# EAGLE design BB-OR-NAND.v1.1 (EAGLE 7.1.0)

## Sheet 1 of 2: NAND
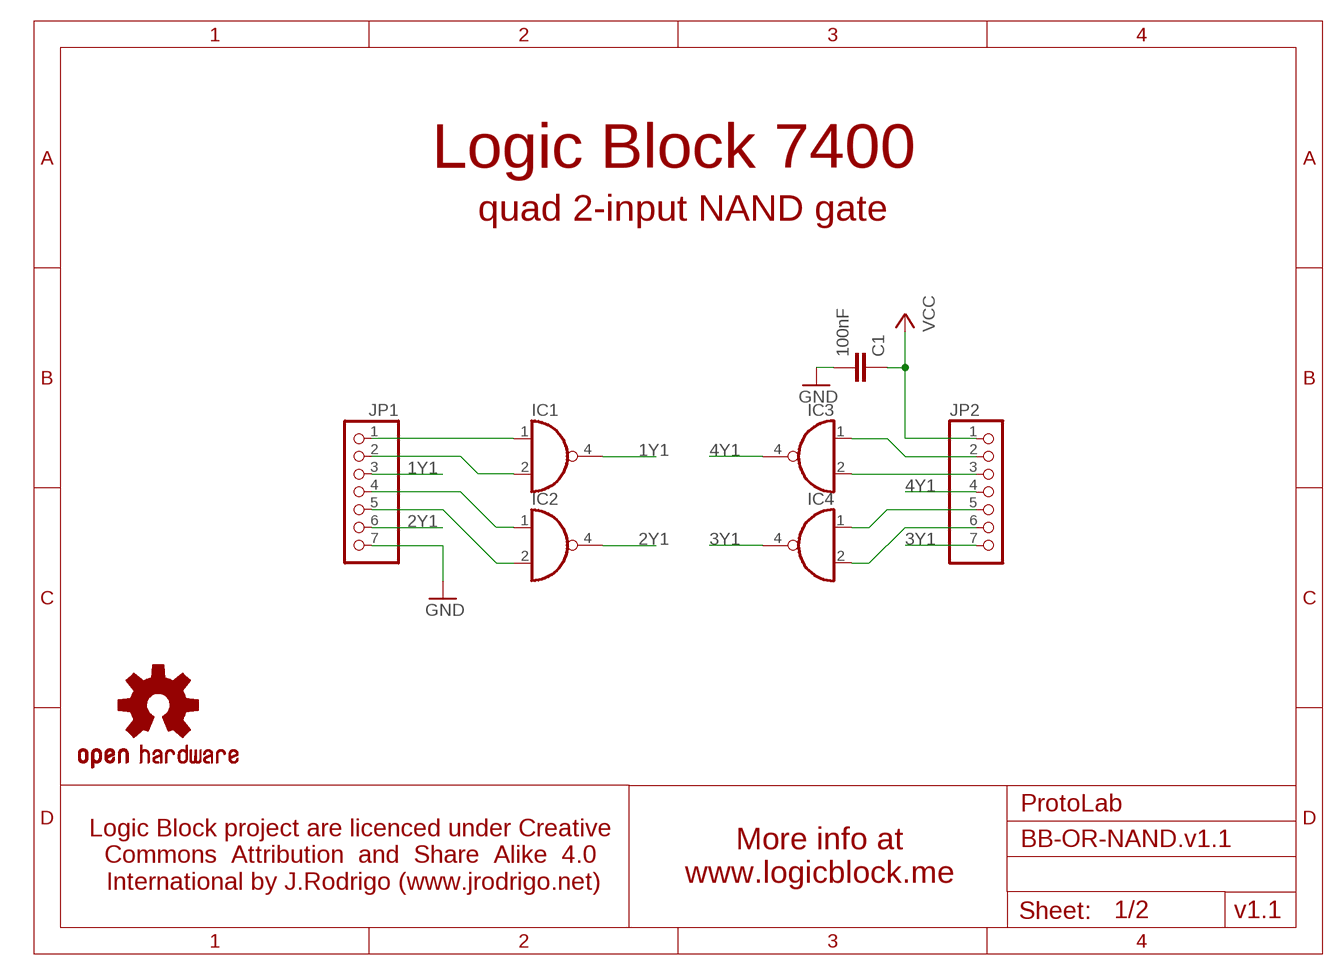
[diagram p0: schematic, sheet 1]

### Parts
C1  100nF  C-EUC0603K  [C0603K]
IC1  74AHC1G00DCK  [SC70-5]
IC2  74AHC1G00DCK  [SC70-5]
IC3  74AHC1G00DCK  [SC70-5]
IC4  74AHC1G00DCK  [SC70-5]
JP1  CON_1X7CLEANBIG  [CON_1X07-CLEANBIG]
JP2  CON_1X7CLEANBIG  [CON_1X07-CLEANBIG]
U$1  OSHW-LOGOS-LAYER230  [OSHW-LOGO-S_LAYER230]

### Nets
1Y1: IC1.4(O) JP1.3
2Y1: IC2.4(O) JP1.6
3Y1: IC4.4(O) JP2.7
4Y1: IC3.4(O) JP2.4
GND: C1.2 JP1.7 ; also sheet 2
N$1: IC1.1(I0) JP1.1
N$2: IC1.2(I1) JP1.2
N$4: IC4.2(I1) JP2.6
N$5: IC2.1(I0) JP1.4
N$6: IC2.2(I1) JP1.5
N$7: IC4.1(I0) JP2.5
N$9: IC3.2(I1) JP2.3
N$10: IC3.1(I0) JP2.2
VCC: C1.1 JP2.1 ; also sheet 2

### Notes on the sheet
- Logic Block 7400
- quad 2-input NAND gate
- ProtoLab
- More info at
  www.logicblock.me
- Logic Block project are licenced under Creative 
  Commons  Attribution  and  Share  Alike  4.0 
  International by J.Rodrigo (www.jrodrigo.net)
- v1.1

## Sheet 2 of 2: OR
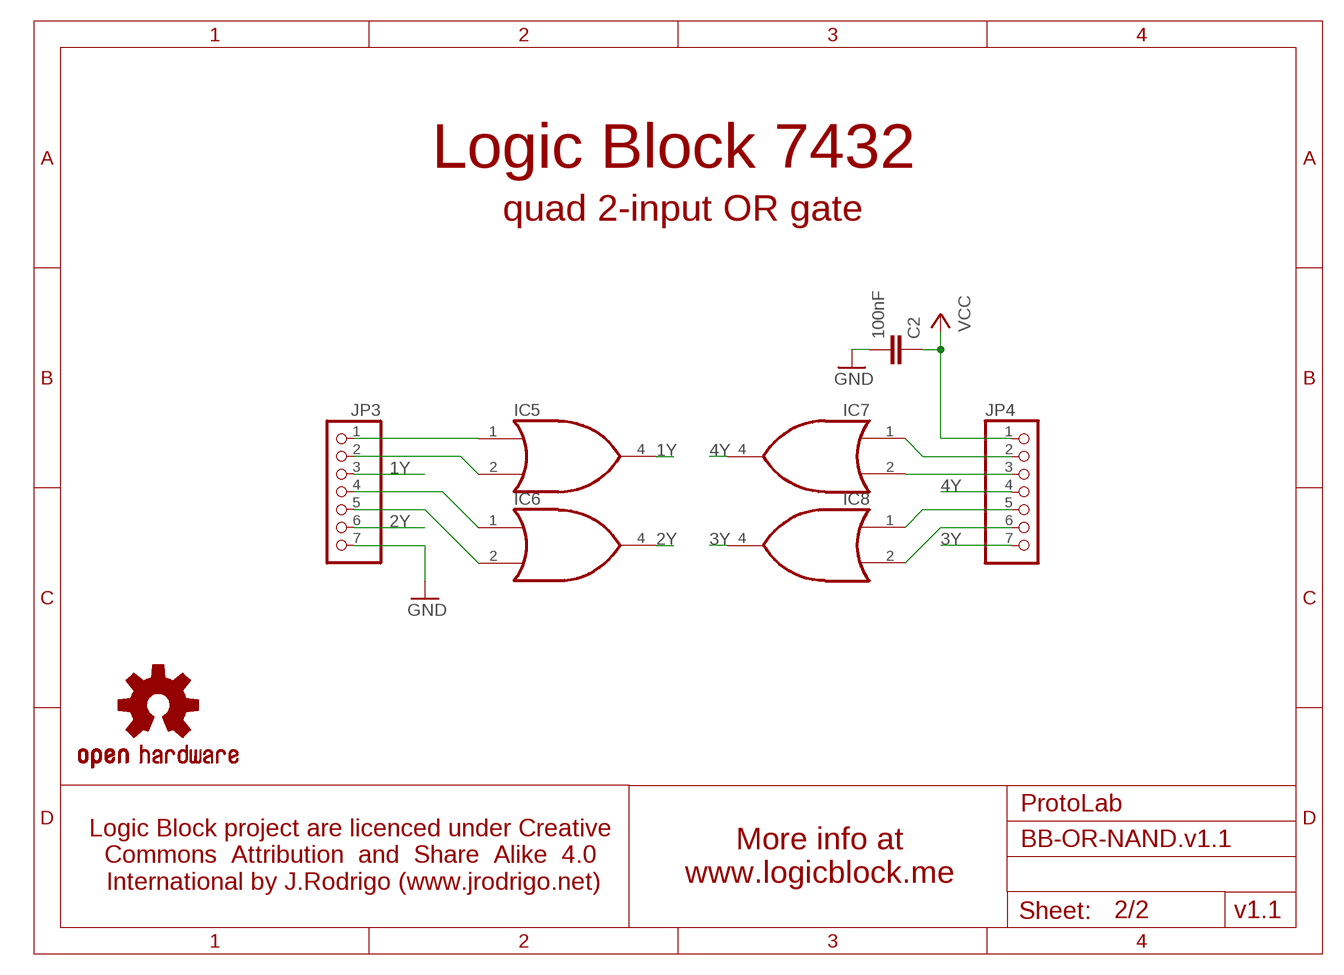
[diagram p1: schematic, sheet 2]

### Parts
C2  100nF  C-EUC0603K  [C0603K]
IC5  74AHC1G32DCK  [SC70-5]
IC6  74AHC1G32DCK  [SC70-5]
IC7  74AHC1G32DCK  [SC70-5]
IC8  74AHC1G32DCK  [SC70-5]
JP3  CON_1X7CLEANBIG  [CON_1X07-CLEANBIG]
JP4  CON_1X7CLEANBIG  [CON_1X07-CLEANBIG]
U$2  OSHW-LOGOS-LAYER230  [OSHW-LOGO-S_LAYER230]

### Nets
1Y: IC5.4(O) JP3.3
2Y: IC6.4(O) JP3.6
3Y: IC8.4(O) JP4.7
4Y: IC7.4(O) JP4.4
GND: C2.2 JP3.7 ; also sheet 1
N$13: IC5.1(I0) JP3.1
N$14: IC5.2(I1) JP3.2
N$16: IC6.1(I0) JP3.4
N$17: IC6.2(I1) JP3.5
N$20: IC8.2(I1) JP4.6
N$21: IC8.1(I0) JP4.5
N$22: IC7.2(I1) JP4.3
N$23: IC7.1(I0) JP4.2
VCC: C2.1 JP4.1 ; also sheet 1

### Notes on the sheet
- Logic Block 7432
- quad 2-input OR gate
- ProtoLab
- More info at
  www.logicblock.me
- Logic Block project are licenced under Creative 
  Commons  Attribution  and  Share  Alike  4.0 
  International by J.Rodrigo (www.jrodrigo.net)
- v1.1

## Power pins joined to a net without a drawn wire
GND: IC1.3(GND) IC2.3(GND) IC3.3(GND) IC4.3(GND) IC5.3(GND) IC6.3(GND) IC7.3(GND) IC8.3(GND)
VCC: IC1.5(VCC) IC2.5(VCC) IC3.5(VCC) IC4.5(VCC) IC5.5(VCC) IC6.5(VCC) IC7.5(VCC) IC8.5(VCC)

## Library data of the parts
C1 C2 = rcl:C-EU: CAPACITOR, European symbol
IC1-IC4 = 74xx-little-de:74*1G00: 2-input NAND gate
IC5-IC8 = 74xx-little-us:74*1G32: 2-input OR gate
JP1-JP4 = Ardublog:CON_1X7: PIN HEADER
U$1 U$2 = logicblock:OSHW-LOGO: Open Source Hardware Logo This logo indicates the piece of hardware it is found on incorporates a OSHW license and/or adheres to the definition of open source hardware found here: http://freedomdefined.org/OSHW

## Board
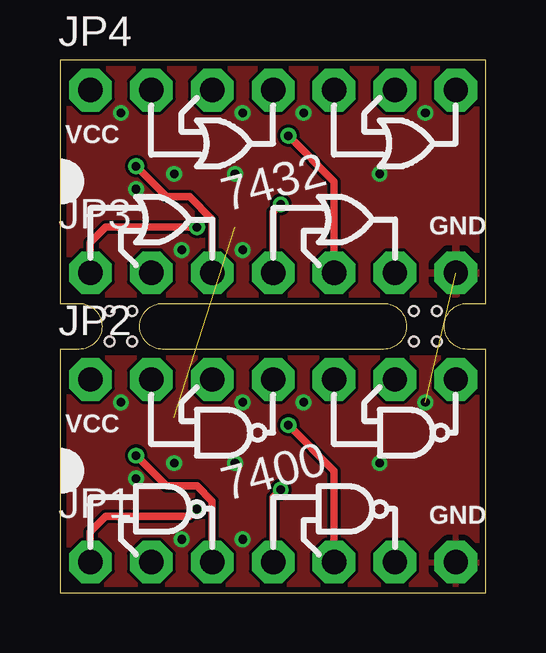
[diagram p2: board, top side]
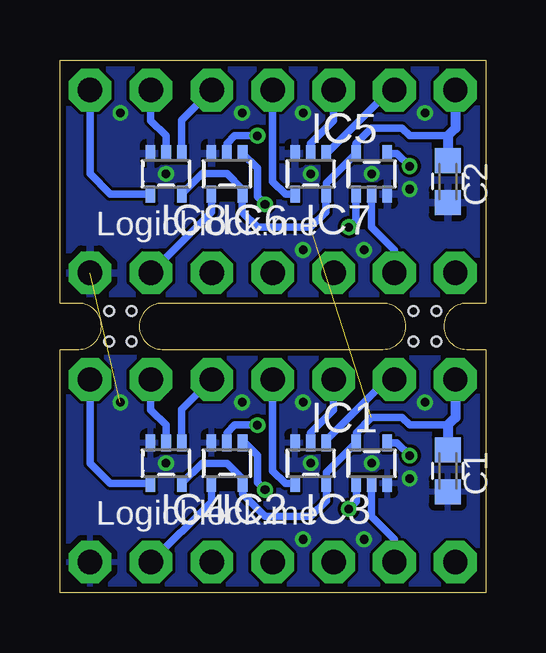
[diagram p3: board, bottom side, seen from below]

Size 17.76 x 22.21 mm. Coordinates in mm from the lower left corner, seen from the top.
Outline: 0,0 17.76,0 17.76,10.15 16.99,10.15 arc-180 16.99,12.06 17.76,12.06 17.76,22.21 0,22.21 0,12.06 0.79,12.06 arc-180 0.79,10.15 0,10.15 0,0
Outline: 13.49,10.15 4.29,10.15 arc-180 4.29,12.06 13.49,12.06 arc-180 13.49,10.15
Copper layers (1*16): Top 0.035mm / dielectric 1.5mm / Bottom 0.035mm
Design rules "dirt_cheap_dirty_boards.v1": minimum track width 5mil, minimum drill 12mil, track to track 5mil, track to pad 5mil, pad to pad 5mil, via to via 5mil, smd to smd 0mil, copper to edge 10mil, drill to drill 10mil, minimum pad ring 10mil, minimum via ring 6mil, stop-mask expansion 2mil, vias tented up to drill 25mil, thermal gap 10mil
Holes 0.4 mm at 2.06,11.75 3.02,11.75 2.06,10.48 3.02,10.48 14.76,11.75 15.72,11.75 15.72,10.48 14.76,10.48
tRestrict: 4 lines
bRestrict: 8 lines

### Footprints (pad centres in the part's own frame; a part is rotated, then mirrored left to right if it is on the bottom)
C0603K = smd 1.05 x 1.08: 1 -0.875,0; 2 0.875,0
SC70-5 = smd 0.4 x 0.7: 1 -0.65,-0.85; 2 0,-0.85; 3 0.65,-0.85; 4 0.65,0.85; 5 -0.65,0.85
CON_1X07-CLEANBIG = drill 1.016 pad 1.778 octagon: 1 -8.89,0; 2 -6.35,0; 3 -3.81,0; 4 -1.27,0; 5 1.27,0; 6 3.81,0; 7 6.35,0

### Placement (x,y rotation side)
C1  1.59,5.08 270 bottom
C2  1.59,17.14 270 bottom
IC1  4.76,5.4 0 bottom
IC2  10.79,5.4 180 bottom
IC3  7.3,5.4 180 bottom
IC4  13.34,5.4 180 bottom
IC5  4.76,17.46 0 bottom
IC6  10.79,17.46 180 bottom
IC7  7.3,17.46 180 bottom
IC8  13.34,17.46 180 bottom
JP1  10.16,1.27 0 top
JP2  10.16,8.89 0 top
JP3  10.16,13.34 0 top
JP4  10.16,20.95 0 top
U$1  16,5.4 0 top
U$2  16,17.46 0 top

### Tracks (layer width: path | path; a pad name or v marks a point on that pad's centre or on a via)
1Y  (via drill 0.36)
  Top 0.305: v3.17,17.78 4.45,16.51 5.4,16.51 6.35,15.56 JP3.3
  Bottom 0.305: IC5.4 3.71,18.31 v3.17,17.78
1Y1  (via drill 0.36)
  Top 0.305: v3.17,5.71 4.45,4.45 5.71,4.45 6.35,3.81 JP1.3
  Bottom 0.305: IC1.4 3.71,6.25 v3.17,5.71
2Y
  Bottom 0.305: IC6.4 11.45,15.86 JP3.6
2Y1
  Bottom 0.305: IC2.4 11.45,3.79 JP1.6
3Y
  Bottom 0.305: IC8.4 15.66,16.61 16.51,17.46 JP4.7
3Y1
  Bottom 0.305: IC4.4 15.66,4.55 16.51,5.4 JP2.7
4Y
  Bottom 0.305: IC7.4 8.36,16.61 8.89,17.14 JP4.4
4Y1
  Bottom 0.305: IC3.4 8.36,4.55 8.89,5.08 JP2.4
GND  (via drill 0.36)  (1 unrouted)
  other vias: 5.08,2.22 2.54,7.94 7.62,7.94 15.24,7.94 7.62,2.22 10.16,7.94 3.17,4.76 4.76,5.4 7.3,5.4 13.34,5.4 2.54,20 7.62,20 10.16,20 15.24,20 13.34,17.46 7.3,17.46 5.08,14.29 7.62,14.29 3.17,16.83 4.76,17.46
  pour Bottom: 0,0 0,10.16 17.78,10.16 17.78,0
  pour Top: 0,0 0,10.16 17.78,10.16 17.78,0
  pour Bottom: 0,12.06 17.78,12.06 17.78,22.23 0,22.23
  pour Top: 0,12.06 17.78,12.06 17.78,22.23 0,22.23
N$1  (via drill 0.36)
  Top 0.305: v5.71,3.49 5.4,3.17 1.91,3.17 1.27,2.54 JP1.1
  Bottom 0.305: IC1.1 5.41,4.43 5.4,4.43 5.4,3.81 v5.71,3.49
N$2
  Bottom 0.305: IC1.2 4.76,3.17 3.81,2.22 JP1.2
N$4
  Bottom 0.305: JP2.6 13.97,7.62 13.34,6.99 IC4.2
N$5  (via drill 0.36)
  Top 0.305: v9.21,4.29 8.89,3.97 JP1.4
  Bottom 0.305: IC2.1 10.14,6.37 10.18,6.37 9.53,5.71 9.53,4.6 v9.21,4.29
N$6  (via drill 0.36)
  Top 0.305: v9.53,6.99 11.43,5.08 JP1.5
  Bottom 0.305: IC2.2 10.79,6.67 10.48,6.99 v9.53,6.99
N$7
  Bottom 0.305: IC4.1 12.69,7.63 JP2.5
N$9
  Bottom 0.305: IC3.2 7.3,6.67 6.35,7.62 JP2.3
N$10
  Bottom 0.305: IC3.1 6.65,6.37 4.13,8.89 JP2.2
N$13  (via drill 0.36)
  Top 0.305: v5.71,15.24 1.91,15.24 1.27,14.61 JP3.1
  Bottom 0.305: IC5.1 5.41,15.54 v5.71,15.24
N$14
  Bottom 0.305: IC5.2 4.76,15.24 3.81,14.29 JP3.2
N$16  (via drill 0.36)
  Top 0.305: v9.21,16.19 8.89,15.88 JP3.4
  Bottom 0.305: IC6.1 9.53,17.69 9.53,16.51 v9.21,16.19
N$17  (via drill 0.36)
  Top 0.305: v9.53,19.05 11.43,17.14 JP3.5
  Bottom 0.305: IC6.2 10.79,18.73 10.48,19.05 v9.53,19.05
N$20
  Bottom 0.305: IC8.2 13.34,19.05 13.97,19.68 JP4.6
N$21
  Bottom 0.305: IC8.1 12.69,19.7 JP4.5
N$22
  Bottom 0.305: IC7.2 7.3,18.73 6.35,19.68 JP4.3
N$23
  Bottom 0.305: IC7.1 4.01,20.95 JP4.2
VCC  (1 unrouted)
  Bottom 0.305: 1.59,6.99 3.17,6.99 3.49,7.3 4.76,7.3 5.4,6.67 5.4,6.33 5.41,6.33 IC1.5 6.65,5.01 IC3.5 6.65,3.83 7.3,3.17 9.21,3.17 10.14,4.11 IC2.5 10.14,4.75 10.79,5.4 11.84,5.4 IC4.5 | 1.59,19.05 3.17,19.05 3.49,19.37 4.76,19.37 5.41,18.72 IC5.5 6.65,17.07 IC7.5 6.67,16.6 6.67,15.88 7.3,15.24 9.53,15.24 10.16,15.88 10.16,16.6 | 10.16,16.6 IC6.5 | 10.16,16.6 10.16,16.83 10.79,17.46 11.84,17.46 IC8.5
  Bottom 0.406: JP2.1 1.27,7.3 1.59,6.99 C1.1 | JP4.1 1.27,19.37 1.59,19.05 C2.1

### Text on the board
tsilkscreen: VCC | 7432 | GND | VCC | 7400 | GND
bsilkscreen: Logicblock.me | Logicblock.me